# Altium schematic sheet SwitchBoard_v4.SchDoc
size A
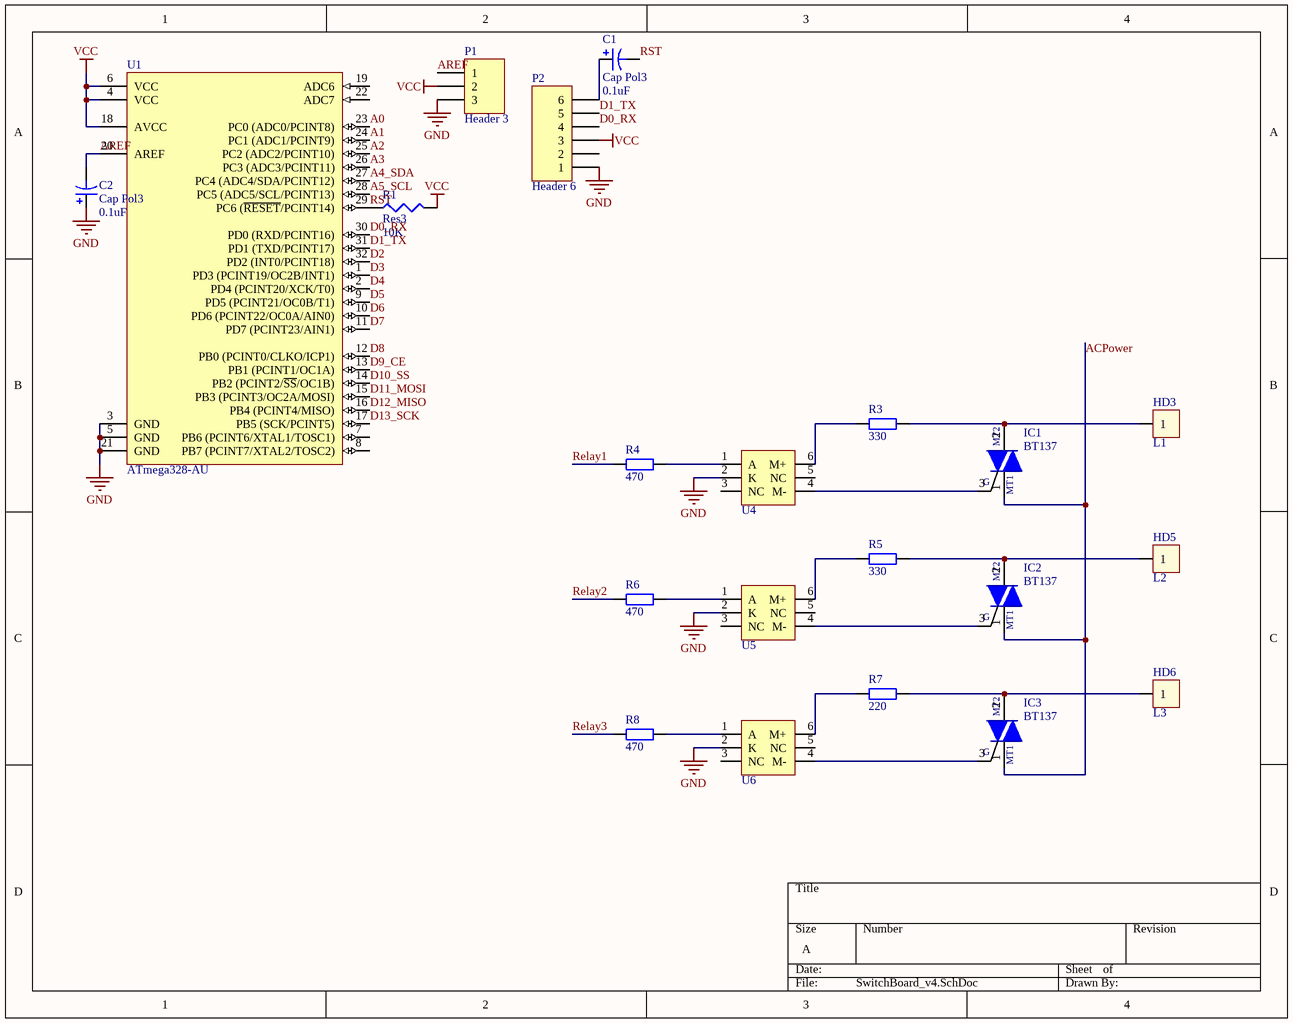
[diagram p0: SwitchBoard_v4.SchDoc]

## Parts
C1  Cap Pol3  value 0.1uF  [C0805]
C2  Cap Pol3  value 0.1uF  [C0805]
HD3  L1  [DOMINO1]
HD5  L2  [DOMINO1]
HD6  L3  [DOMINO1]
IC1  BT137  [QTO-220]
IC2  BT137  [QTO-220]
IC3  BT137  [QTO-220]
P1  Header 3  [HDR1X3]
P2  Header 6  [HDR1X6]
R1  Res3  value 10K  [J1-0603]
R3  330  [R1/4W]
R4  470  [R1/4W]
R5  330  [R1/4W]
R6  470  [R1/4W]
R7  220  [R1/4W]
R8  470  [R1/4W]
U1  ATmega328-AU  [32A_N]
U4  MOC3021M  [MOC30XX]  (value not drawn)
U5  MOC3021M  [MOC30XX]  (value not drawn)
U6  MOC3021M  [MOC30XX]  (value not drawn)

## Nets
GND: C2.1 P1.3 P2.1 U1.3(GND) U1.5(GND) U1.21(GND) U4.2(K) U5.2(K) U6.2(K)
VCC: P1.2 P2.3 R1.2 U1.4(VCC) U1.6(VCC) U1.18(AVCC)
A0: U1.23(PC0_(ADC0/PCINT8))
A1: U1.24(PC1_(ADC1/PCINT9))
A2: U1.25(PC2_(ADC2/PCINT10))
A3: U1.26(PC3_(ADC3/PCINT11))
A4_SDA: U1.27(PC4_(ADC4/SDA/PCINT12))
A5_SCL: U1.28(PC5_(ADC5/SCL/PCINT13))
ACPower: IC1.1(MT1) IC2.1(MT1) IC3.1(MT1)
AREF: C2.2 P1.1 U1.20(AREF)
D0_RX: P2.4 U1.30(PD0_(RXD/PCINT16))
D1_TX: P2.5 U1.31(PD1_(TXD/PCINT17))
D2: U1.32(PD2_(INT0/PCINT18))
D3: U1.1(PD3_(PCINT19/OC2B/INT1))
D4: U1.2(PD4_(PCINT20/XCK/T0))
D5: U1.9(PD5_(PCINT21/OC0B/T1))
D6: U1.10(PD6_(PCINT22/OC0A/AIN0))
D7: U1.11(PD7_(PCINT23/AIN1))
D8: U1.12(PB0_(PCINT0/CLKO/ICP1))
D9_CE: U1.13(PB1_(PCINT1/OC1A))
D10_SS: U1.14(PB2_(PCINT2/~{SS}/OC1B))
D11_MOSI: U1.15(PB3_(PCINT3/OC2A/MOSI))
D12_MISO: U1.16(PB4_(PCINT4/MISO))
D13_SCK: U1.17(PB5_(SCK/PCINT5))
Relay1: R4.1
Relay2: R6.1
Relay3: R8.1
RST: C1.2 R1.1 U1.29(PC6_(~{RESET}/PCINT14))
NetC1_1: C1.1 P2.6
NetHD3_1: HD3.1 IC1.2(MT2) R3.2
NetHD5_1: HD5.1 IC2.2(MT2) R5.2
NetHD6_1: HD6.1 IC3.2(MT2) R7.2
NetIC1_3: IC1.3(IN) U4.4(M-)
NetIC2_3: IC2.3(IN) U5.4(M-)
NetIC3_3: IC3.3(IN) U6.4(M-)
NetR3_1: R3.1 U4.6(M+)
NetR4_2: R4.2 U4.1(A)
NetR5_1: R5.1 U5.6(M+)
NetR6_2: R6.2 U5.1(A)
NetR7_1: R7.1 U6.6(M+)
NetR8_2: R8.2 U6.1(A)

Not connected (* = marked no-connect by the designer): P2 2; U1 7(PB6_(PCINT6/XTAL1/TOSC1)) 8(PB7_(PCINT7/XTAL2/TOSC2)) 19(ADC6) 22(ADC7); U4 3(NC) 5(NC); U5 3(NC) 5(NC); U6 3(NC) 5(NC)

## Notes on the sheet
- (in symbol BT137) G

## Library data of the parts
C1 C2 = Cap Pol3: Polarized Capacitor (Surface Mount); Published: 8-Jun-2000; LatestRevisionDate: 29-May-2009; LatestRevisionNote: IPC-7351 Footprint Added.; PackageReference: C0805; Publisher: Altium Limited; PackageDescription: Chip Capacitor
HD3 HD5 HD6 = Domino1: Header 2 (Green); Value: Header 2
IC1-IC3 = BT137: Triacs - 8A; Value: LM317
P1 = Header 3: Header, 3-Pin; LatestRevisionDate: 17-Jul-2002; LatestRevisionNote: Re-released for DXP Platform.; Publisher: Altium Limited
P2 = Header 6: Header, 6-Pin; LatestRevisionDate: 17-Jul-2002; LatestRevisionNote: Re-released for DXP Platform.; Publisher: Altium Limited
R1 = Res3: Resistor; Published: 8-Jun-2000; LatestRevisionDate: 29-May-2009; LatestRevisionNote: IPC-7351 Footprint Added.; PackageReference: J1-0603; Publisher: Altium Limited; PackageDescription: Chip Resistor
R3-R8 = R1/4W: Resistor 1/4W; Value: R1/4W - 1K
U1 = ATmega328-AU: 8-bit AVR Microcontroller, 32KB Flash, 1KB EEPROM, 2KB SRAM, 32-pin TQFP, Industrial Grade (-40°C to 85°C); Published: 1-Apr-2010; DatasheetVersion: revA, Jan-2010; PackageVersion: revB, Oct-2001; PackageReference: 32A; Publisher: Altium Limited; PackageDescription: 32-Lead, 7x7x1.0 mm Body, 0.8mm Lead Pitch, Thin Profile Plastic Quad Flat Package (TQFP); Supplier 1: Digi-Key; Supplier Part Number 1: ATMEGA328-AU-ND; Supplier 2: Mouser; Supplier Part Number 2: 556-ATMEGA328-AU; Code_JEDEC: MS-026-ABA; ComponentLink1Description: Manufacturer Link; ComponentLink1URL: http://www.atmel.com/products/avr/default.asp?; ComponentLink2Description: ATmega48A/48PA/88A/88PA/168A/168PA/328/328P Datasheet; ComponentLink2URL: http://www.atmel.com/dyn/resources/prod_documents/8271.pdf; ComponentLink3Description: ATmega48A/48PA/88A/88PA/168A/168PA/328/328P Summary; ComponentLink3URL: http://www.atmel.com/dyn/resources/prod_documents/8271S.pdf; ComponentLink4Description: Atmel.com Home; ComponentLink4URL: http://www.atmel.com